# Altium project ee_453_yourname.PrjPcb (part 2 of 2)
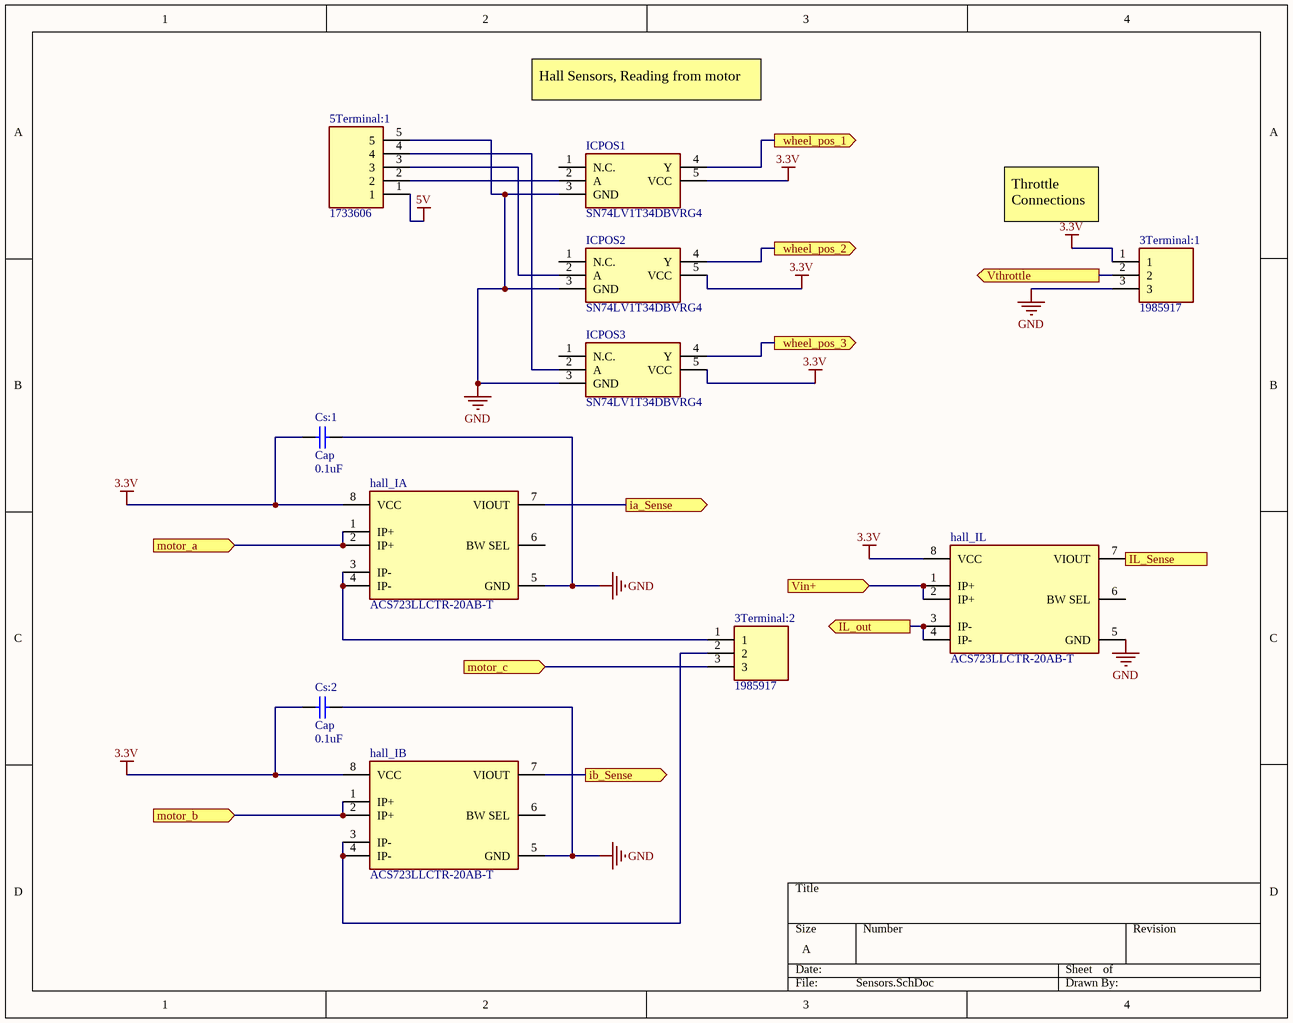
[diagram p7: Sensors.SchDoc]

## Nets that join several sheets
3.3V: TI_DSP_OLD (UDSP.1), PowerSupply (OP-AMP1.8 PS1#2.6), BoostStage (OP-AMP2.8), Sensors (9 pins)
5V: PowerSupply (Rdiv5.2 Rdiv6.1), Sensors (5Terminal:1.1)
12V: PowerSupply (PS2#2.6), BoostStage (Cby8.1 IC1_Socket.5 Rboot.2)
15V: PowerSupply (PS3#2.6), DrivePowerModule (10 pins)
 GND: ee453_pcb_yourname (14 pins), TI_DSP_OLD (UDSP.22), PowerSupply (14 pins), BoostStage (22 pins), DrivePowerModule (17 pins), Sensors (10 pins)
TP8: TI_DSP_OLD (UDSP.80), BoostStage (IC1_Socket.1)
Net3Terminal:2_3: DrivePowerModule (U.26), Sensors (3Terminal:2.3)
Net48V_test_1: BoostStage (13 pins), DrivePowerModule (C7.1 U.27)
NetBobbin_1: BoostStage (5 pins), Sensors (hall_IL.3 hall_IL.4)
NetC1:7_2: TI_DSP_OLD (UDSP.15), DrivePowerModule (C1:7.2 R1:7.2)
NetCdc24V_1: PowerSupply (9 pins), Sensors (hall_IL.1 hall_IL.2)
Nethall_IA_1: DrivePowerModule (U.24), Sensors (hall_IA.1 hall_IA.2)
Nethall_IA_7: TI_DSP_OLD (UDSP.26), Sensors (hall_IA.7)
Nethall_IB_1: DrivePowerModule (U.25), Sensors (hall_IB.1 hall_IB.2)
Nethall_IB_7: TI_DSP_OLD (UDSP.27), Sensors (hall_IB.7)
Nethall_IL_7: TI_DSP_OLD (UDSP.69), Sensors (hall_IL.7)
NetIC1_Socket_2: TI_DSP_OLD (UDSP.9), BoostStage (IC1_Socket.2)
NetOP-AMP2_1: TI_DSP_OLD (UDSP.70), BoostStage (OP-AMP2.1 OP-AMP2.2)
NetR1:1_2: TI_DSP_OLD (UDSP.36), DrivePowerModule (R1:1.2)
NetR1:2_2: TI_DSP_OLD (UDSP.38), DrivePowerModule (R1:2.2)
NetR1:3_2: TI_DSP_OLD (UDSP.40), DrivePowerModule (R1:3.2)
NetR1:4_2: TI_DSP_OLD (UDSP.35), DrivePowerModule (R1:4.2)
NetR1:5_2: TI_DSP_OLD (UDSP.37), DrivePowerModule (R1:5.2)
NetR1:6_2: TI_DSP_OLD (UDSP.39), DrivePowerModule (R1:6.2)